# Altium schematic sheet Connectors.SchDoc
size A4; CompanyName: Technische Hochschule Nürnberg Georg Simon Ohm; Organization: UltraZohm; Address1: Kesslerplatz 12; Address2: 90489 Nürnberg; Address3: GERMANY; SheetNumber: 1; SheetTotal: 1; Website: www.ultrazohm.com
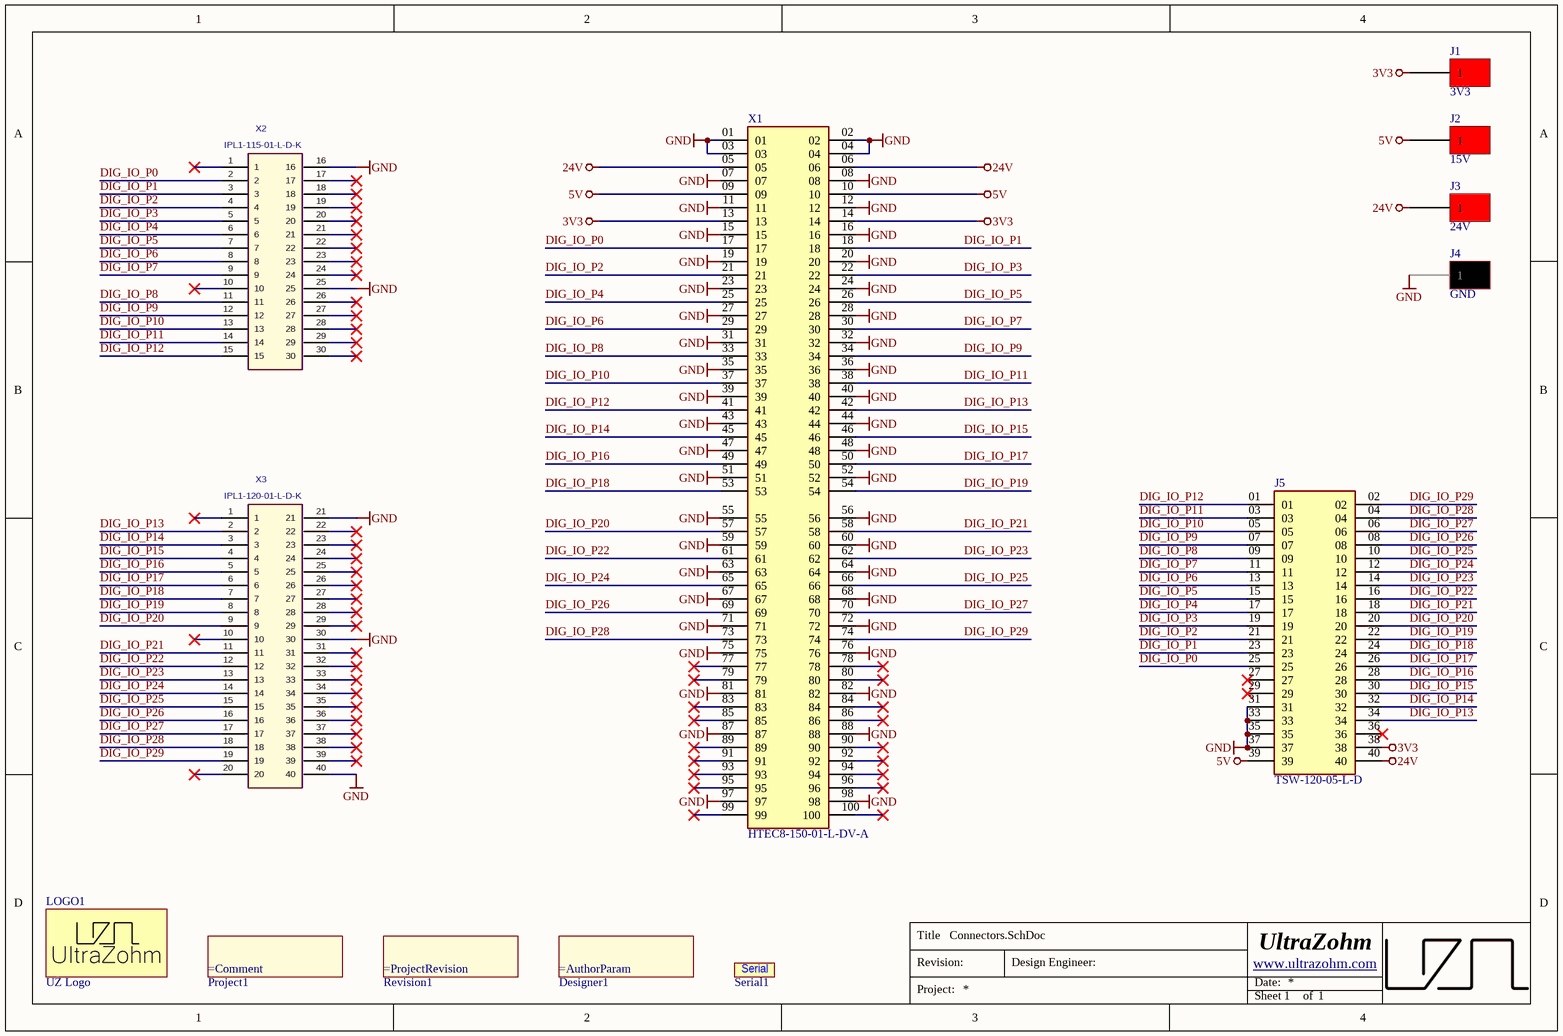
[diagram p0: Connectors.SchDoc]

## Parts
Designer1  (no value)  [Designator:comment]  (no BOM)
J1  value 3V3  [FCR7350]  (hidden comment: FCR7350R, PCB mount 4mm jack, RED)
J2  value 15V  [FCR7350]  (hidden comment: FCR7350R, PCB mount 4mm jack, RED)
J3  value 24V  [FCR7350]  (hidden comment: FCR7350R, PCB mount 4mm jack, RED)
J4  value GND  [FCR7350]  (hidden comment: FCR7350B, PCB mount 4mm jack, BLACK)
J5  TSW-120-05-L-D  [SAMTEC_TSW-120-05-L-D]
LOGO1  UZ Logo  [UZ_Logo_small]  (no BOM)
Project1  (no value)  [COMMENT]  (no BOM)
Revision1  (no value)  [Designator:comment]  (no BOM)
Serial1  Serial #  [SERIAL]  (value not drawn)
X1  HTEC8-150-01-L-DV-A  [SAMTEC_HSEC8-150-01-X-DV-A]
X2  IPL1-115-01-L-D-K  [IPL1-115-01-YYY-D-K]
X3  IPL1-120-01-L-D-K  [SAMTEC_IPL1-120-01-X-D-K]

## Nets
3V3: J1.1 J5.38 X1.13 X1.14
5V: J2.1 J5.39 X1.09 X1.10
24V: J3.1 J5.40 X1.05 X1.06
GND: J4.1 J5.31 J5.33 J5.35 J5.37 X1.01 X1.02 X1.03 X1.04 X1.07 X1.08 X1.11 X1.12 X1.15 X1.16 X1.19 X1.20 X1.23 X1.24 X1.27 X1.28 X1.31 X1.32 X1.35 X1.36 X1.39 X1.40 X1.43 X1.44 X1.47 X1.48 X1.51 X1.52 X1.55 X1.56 X1.59 X1.60 X1.63 X1.64 X1.67 X1.68 X1.71 X1.72 X1.75 X1.76 X1.81 X1.82 X1.87 X1.88 X1.97 X1.98 X2.16 X2.25 X3.21 X3.30 X3.40
DIG_IO_P0: J5.25 X1.17 X2.2
DIG_IO_P1: J5.23 X1.18 X2.3
DIG_IO_P2: J5.21 X1.21 X2.4
DIG_IO_P3: J5.19 X1.22 X2.5
DIG_IO_P4: J5.17 X1.25 X2.6
DIG_IO_P5: J5.15 X1.26 X2.7
DIG_IO_P6: J5.13 X1.29 X2.8
DIG_IO_P7: J5.11 X1.30 X2.9
DIG_IO_P8: J5.09 X1.33 X2.11
DIG_IO_P9: J5.07 X1.34 X2.12
DIG_IO_P10: J5.05 X1.37 X2.13
DIG_IO_P11: J5.03 X1.38 X2.14
DIG_IO_P12: J5.01 X1.41 X2.15
DIG_IO_P13: J5.34 X1.42 X3.2
DIG_IO_P14: J5.32 X1.45 X3.3
DIG_IO_P15: J5.30 X1.46 X3.4
DIG_IO_P16: J5.28 X1.49 X3.5
DIG_IO_P17: J5.26 X1.50 X3.6
DIG_IO_P18: J5.24 X1.53 X3.7
DIG_IO_P19: J5.22 X1.54 X3.8
DIG_IO_P20: J5.20 X1.57 X3.9
DIG_IO_P21: J5.18 X1.58 X3.11
DIG_IO_P22: J5.16 X1.61 X3.12
DIG_IO_P23: J5.14 X1.62 X3.13
DIG_IO_P24: J5.12 X1.65 X3.14
DIG_IO_P25: J5.10 X1.66 X3.15
DIG_IO_P26: J5.08 X1.69 X3.16
DIG_IO_P27: J5.06 X1.70 X3.17
DIG_IO_P28: J5.04 X1.73 X3.18
DIG_IO_P29: J5.02 X1.74 X3.19

Not connected (* = marked no-connect by the designer): J5 27* 29* 36*; X1 77* 78* 79* 80* 83* 84* 85* 86* 89* 90* 91* 92* 93* 94* 95* 96* 99* 100*; X2 1* 10* 17* 18* 19* 20* 21* 22* 23* 24* 26* 27* 28* 29* 30*; X3 1* 10* 20* 22* 23* 24* 25* 26* 27* 28* 29* 31* 32* 33* 34* 35* 36* 37* 38* 39*

## Notes on the sheet
- Title
- Revision:
- Design Engineer:
- Date:
- Project:
- Sheet
- of
- (in symbol 6) Serial

## Library data of the parts
Designer1 = 4: Create a project parameter named "Author" this is the value of this component. It is printed on the PCB. Once the parameter is updated (e.g. new revision) it gets updated on the PCB as well; Manufacturer: PCB Manufacturer; Manufacturer Part Number: Project Author; Created from: T. Wendt; PartID: 4; Created On: 01.03.2021 08:53:41; Component Type: Project Author; Last Updated: 01.03.2021 09:20:27; Type: Standard (No BOM); Value: =AuthorParam; Live Cycle Status: 1
J1-J3 = FCR7350R: FCR7350B, 1000V, 24A, RED; Manufacturer: Cliff; Created from: DHufnagel; Manufacturer Part Number: FCR7350R; PartID: 7; Created On: 13.06.2022 10:18:11; ComponentLink1Description: datasheet; ComponentLink1URL: https://www.cliffuk.co.uk/products/testleads/sockets/S16NPC.pdf; ComponentLink2Description: drawing; ComponentLink2URL: https://media.digikey.com/pdf/Data%20Sheets/Cliff%20Electronic%20LTD%20PDF's/FCR7350_Drawing.pdf; Component Type: PCB mount 4mm jack, Red; Device Package: THT; Last Updated: 28.06.2022 13:58:37; Minimum Order: 1; Mounting Type: THT; Operating Temperature: -40°C - 80°C; Series: S16N-PC; Supplier 1: Digi-Key; Supplier Part Number 1: 3185-FCR7350R-ND; Supplier 2: farnell; Supplier Part Number 2: 1854508; Type: PCB mount 4mm jack, Red FCR7350R, 1000V, 24A; Live Cycle Status: 1; Stock number: not stored
J4 = FCR7350B: FCR7350B, 1000V, 24A, BLACK; Manufacturer: Cliff; Created from: DHufnagel; Manufacturer Part Number: FCR7350B; PartID: 6; Created On: 13.06.2022 10:18:11; ComponentLink1Description: datasheet; ComponentLink1URL: https://www.cliffuk.co.uk/products/testleads/sockets/S16NPC.pdf; ComponentLink2Description: drawing; ComponentLink2URL: https://media.digikey.com/pdf/Data%20Sheets/Cliff%20Electronic%20LTD%20PDF's/FCR7350_Drawing.pdf; Component Type: PCB mount 4mm jack, Black; Device Package: THT; Last Updated: 28.06.2022 13:58:37; Minimum Order: 1; Mounting Type: THT; Operating Temperature: -40°C - 80°C; Series: S16N-PC; Supplier 1: Digi-Key; Supplier Part Number 1: 3185-FCR7350B-ND; Supplier 2: farnell; Supplier Part Number 2: 1854507; Type: PCB mount 4mm jack, Black	FCR7350B, 1000V, 24A; Live Cycle Status: 1; Stock number: not stored
J5 = TSW-120-05-L-D: THROUGH-HOLE .025" SQ POST HEADER; Manufacturer: SAMTEC; Created from: NDiringer; Number of positions: 40; Package: None; Price: None; Value: *; MP: TSW-120-05-L-D; Availability: Unavailable; Manufacturer Part Number: TSW-120-05-L-D; PartID: 11; Created On: 21.06.2022 12:48:34; ComponentLink1Description: Datasheet; ComponentLink1URL: https://www.mouser.de/datasheet/2/527/tsw_th-2854687.pdf; Component Type: Pin Header; Last Updated: 13.07.2022 10:35:26; Mounting Type: THT; Operating Temperature: -55 +125 °C; Series: TSW; Supplier 1: Mouser; Supplier Part Number 1: 200-TSW12005LD; Type: Pin Header; Live Cycle Status: 1; Stock number: not stored
LOGO1 = Logo small: Manufacturer: UltraZohm; Created from: MGremer; Created: Jan2021_Liegmann; Value: Logo; Manufacturer Part Number: Logo small; PartID: 10; Created On: 03.11.2021 09:04:23; ComponentLink1Description: https://docs.ultrazohm.com/; ComponentLink1URL: homepage; Component Type: Logo; Last Updated: 03.11.2021 09:05:50; Supplier 1: -; Supplier Part Number 1: -; Type: Logo; Live Cycle Status: 1
Project1 = 2: Create a project parameter named "ProjectNameCustom" this is the value of this component and it is printed on the PCB.; Manufacturer: PCB Manufacturer; Created from: T. Wendt; PartID: 2; Created On: 01.03.2021 08:43:57; Component Type: Project Name; Last Updated: 01.03.2021 09:07:27; Manufacturer Part Number: Project Name; Type: Standard (No BOM); Value: =ProjectNameCustom; Live Cycle Status: 1
Revision1 = 3: Create a project parameter named "ProjectRevision" this is the value of this component. It is printed on the PCB. Once the parameter is updated (e.g. new revision) it gets updated on the PCB as well; Manufacturer: PCB Manufacturer; Created from: T. Wendt; PartID: 3; Created On: 01.03.2021 08:50:34; Component Type: Project Revision; Last Updated: 01.03.2021 09:28:36; Manufacturer Part Number: Project Revision; Type: Standard (No BOM); Value: =ProjectRevision; Live Cycle Status: 1
Serial1 = 6: Field to put in a serial number; Manufacturer: PCB Manufacturer; Created from: T. Wendt; PartID: 6; Created On: 02.03.2021 14:31:24; Component Type: Serial Number; Last Updated: 02.03.2021 14:31:24; Manufacturer Part Number: Serial Number; Type: Standard (No BOM); Live Cycle Status: 1
X1 = HTEC8-150-01-L-DV-A: 0.80 mm Rugged High-Speed Edge Card Connector; MF: Samtec; Created from: PBaumann; Number of positions: 50; MP: HSEC8-150-01-X-DV-A; Package: None; Availability: Unavailable; Price: None; Value: *; Manufacturer Part Number: HTEC8-150-01-L-DV-A; PartID: 37; Created On: 05.03.2021 11:38:50; ComponentLink1Description: Homepage; ComponentLink1URL: https://www.samtec.com/products/htec8-150-01-l-dv-k; Component Type: Samtec Connector; Device Package: Connector; Last Updated: 30.11.2022 10:11:19; Manufacturer: SAMTEC; Mounting Type: SMD; Supplier 1: SAMTEC; Supplier Part Number 1: HTEC8-150-01-L-DV-A; Type: Connector; Live Cycle Status: 1; Number of rows: 2; Stock number: not stored
X2 = IPL1-115-01-L-D-K: 2.54 mm Double Row Terminal Assembly; Manufacturer: SAMTEC; Created from: MGremer; Number of positions: 30; Manufacturer Part Number: IPL1-115-01-L-D-K; PartID: 28; Created On: 01.12.2020 18:14:32; ComponentLink1Description: Homepage; ComponentLink1URL: https://www.samtec.com/de/products/ipl1; Component Type: Samtec Connector; Device Package: Connector; Last Updated: 15.02.2021 10:08:03; Mounting Type: THT; Supplier 1: SAMTEC; Supplier Part Number 1: IPL1-115-01-L-D-K; Type: Connector; Live Cycle Status: 1; Number of rows: 2; Stock number: not stored
X3 = IPL1-120-01-L-D-K: Terminal Assembly, Double Row, Thru-Hole, 2.54 mm x 2.54 mm Pitch, 40 Pins; Manufacturer: SAMTEC; Created from: PBaumann; Number of positions: 40; Manufacturer Part Number: IPL1-120-01-L-D-K; PartID: 42; Created On: 24.03.2021 02:48:34; ComponentLink1Description: Homepage; ComponentLink1URL: https://www.samtec.com/products/ipl1; Component Type: Samtec Connector; Device Package: Connector; Last Updated: 27.05.2022 12:12:18; Mounting Type: THT; Supplier 1: SAMTEC; Supplier Part Number 1: IPL1-120-01-L-D-K; Type: Connector; Live Cycle Status: 1; Number of rows: 2; Stock number: not stored